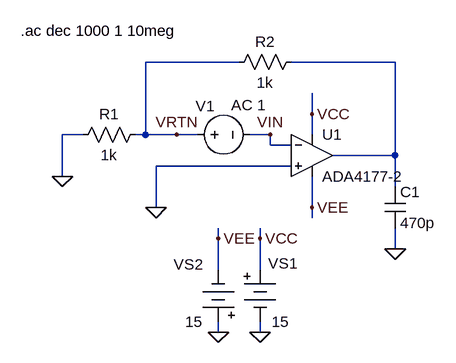
[diagram p0: schematic fig-03-01-27.asc]
fig-03-01-27.asc, the LTspice schematic file:
Version 4
SHEET 1 880 680
WIRE 256 32 112 32
WIRE 496 32 336 32
WIRE 368 112 368 80
WIRE 16 144 -16 144
WIRE 112 144 112 32
WIRE 112 144 96 144
WIRE 160 144 112 144
WIRE 192 144 160 144
WIRE 304 144 272 144
WIRE 368 144 368 112
WIRE 304 160 304 144
WIRE 336 160 304 160
WIRE 496 176 496 32
WIRE 496 176 400 176
WIRE 336 192 128 192
WIRE -16 208 -16 144
WIRE 496 224 496 176
WIRE 128 256 128 192
WIRE 368 256 368 208
WIRE 368 272 368 256
WIRE 224 304 224 288
WIRE 288 304 288 288
WIRE 496 320 496 288
WIRE 224 352 224 304
WIRE 288 352 288 304
WIRE 224 448 224 432
WIRE 288 448 288 432
FLAG 128 256 0
FLAG -16 208 0
FLAG 224 448 0
FLAG 288 448 0
FLAG 224 304 VEE
FLAG 288 304 VCC
FLAG 368 112 VCC
FLAG 368 256 VEE
FLAG 496 320 0
FLAG 160 144 VRTN
FLAG 304 144 VIN
SYMBOL res 352 16 R90
WINDOW 0 0 56 VBottom 2
WINDOW 3 32 56 VTop 2
SYMATTR InstName R2
SYMATTR Value 1k
SYMBOL Misc\\battery 288 336 R0
WINDOW 0 13 6 Left 2
WINDOW 3 18 96 Left 2
SYMATTR InstName VS1
SYMATTR Value 15
SYMBOL Misc\\battery 224 448 R180
WINDOW 0 24 104 Left 2
WINDOW 3 24 16 Left 2
SYMATTR InstName VS2
SYMATTR Value 15
SYMBOL res 112 128 R90
WINDOW 0 0 56 VBottom 2
WINDOW 3 32 56 VTop 2
SYMATTR InstName R1
SYMATTR Value 1k
SYMBOL voltage 176 144 R270
WINDOW 3 -77 115 Left 2
WINDOW 123 46 68 VRight 2
WINDOW 39 0 0 Left 0
WINDOW 0 44 13 VRight 2
SYMATTR Value ""
SYMATTR Value2 AC 1
SYMATTR InstName V1
SYMBOL cap 480 224 R0
SYMATTR InstName C1
SYMATTR Value 470p
SYMBOL Opamps\\ADA4177-2 368 176 R0
SYMATTR InstName U1
TEXT -80 -16 Left 2 !.ac dec 1000 1 10meg

The netlist it stands for:
* fig-03-01-27.asc
R2 N001 VRTN 1k
VS1 VCC 0 15
VS2 0 VEE 15
R1 VRTN 0 1k
V1 VRTN VIN AC 1
C1 N001 0 470p
* U1: ADA4177-2 (symbol Opamps\ADA4177-2 not available, pins judged from their places): In+=0 In-=VIN V+=VCC V-=VEE OUT=N001
.ac dec 1000 1 10meg
.backanno
.end